# EAGLE schematic Fostex_CTRL (EAGLE 6.4)
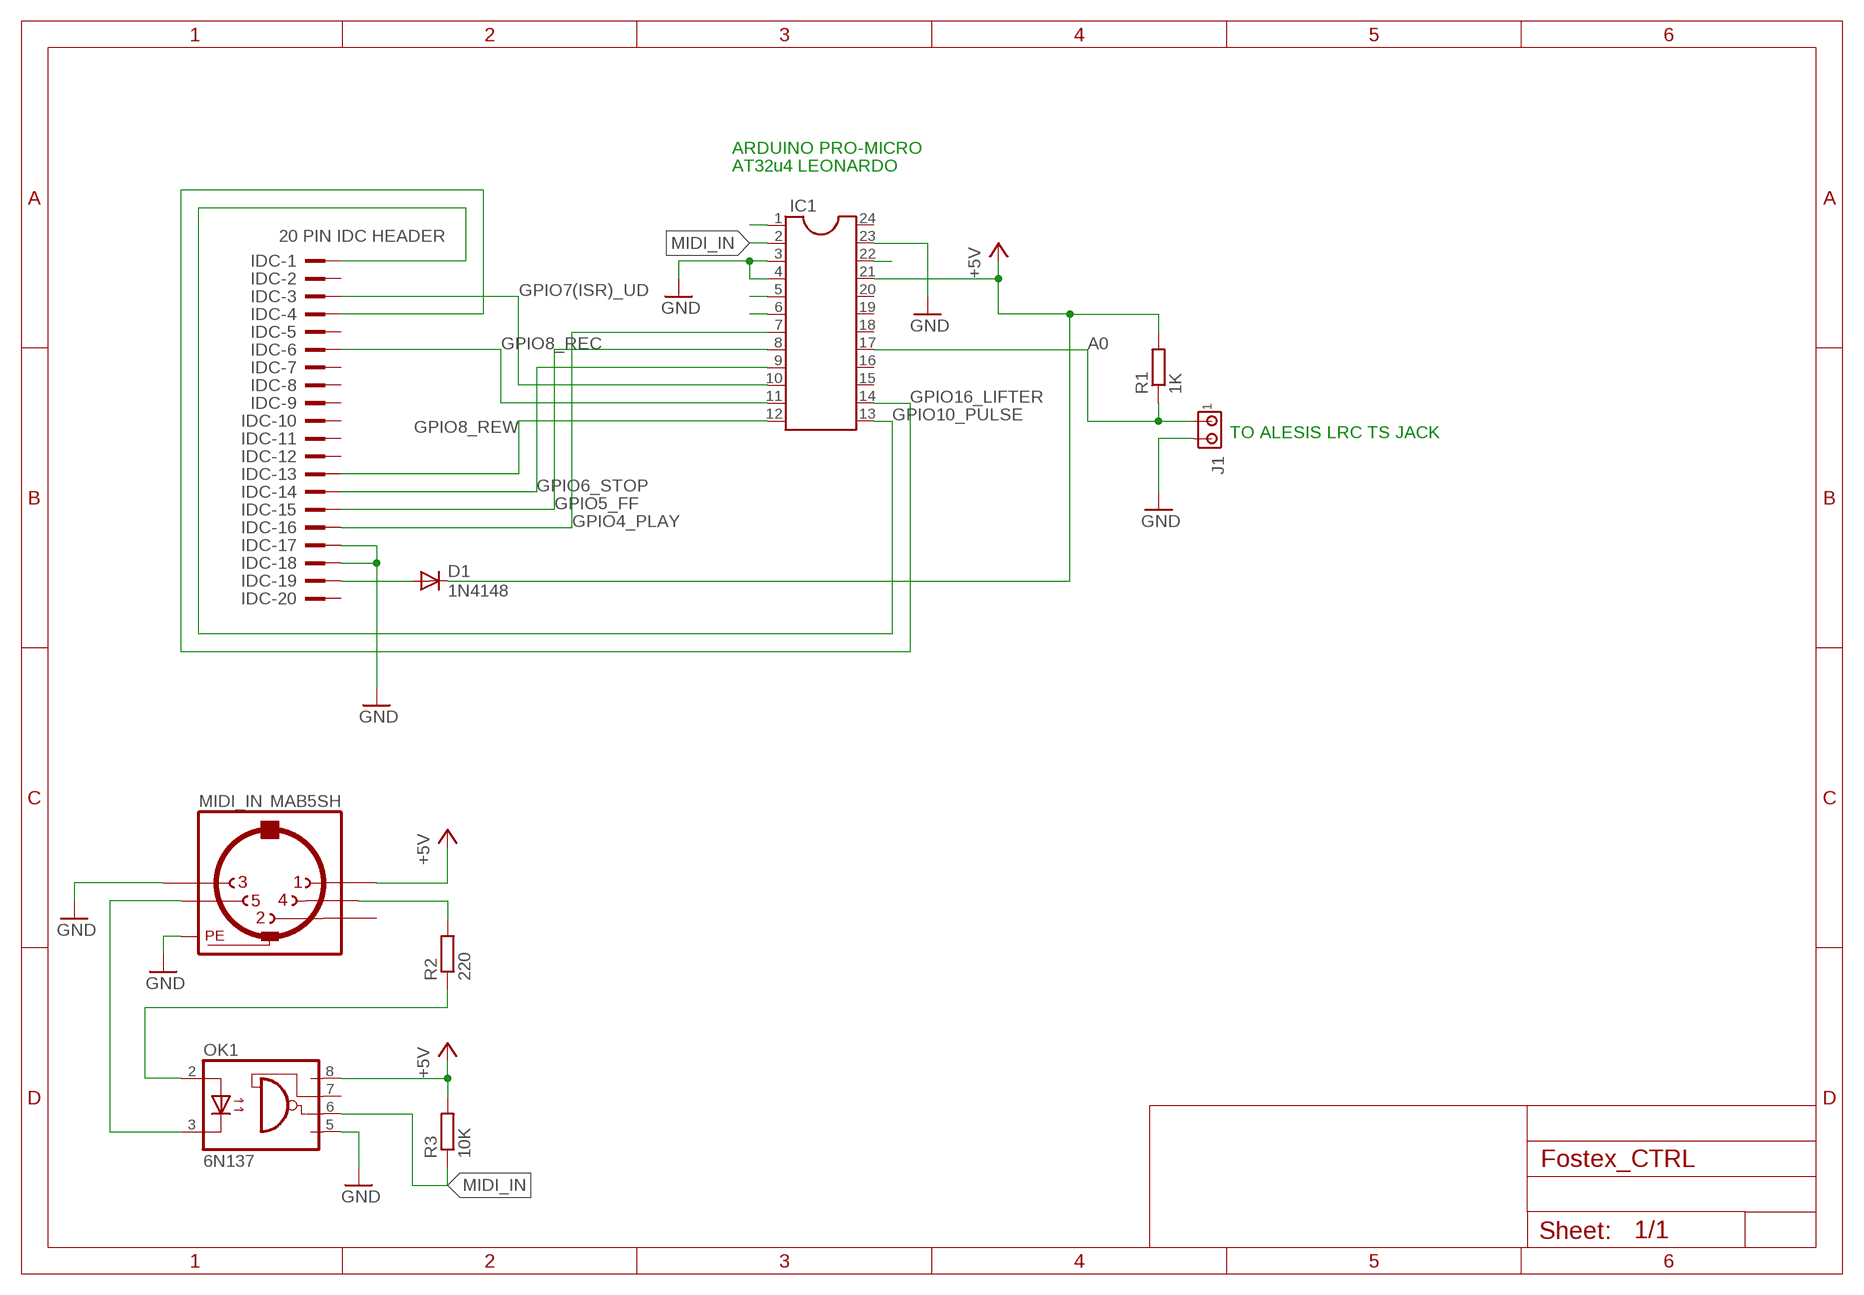
[diagram p0: schematic, sheet 1]

## Parts
D1  1N4148  1N4148DO35-7  [DO35-7]
IC1  DIL24-6  [DIL24-6]
IDC  20 PIN IDC HEADER  2520-  [PAK100/2500-20]
J1  MTA02-100  [10X02MTA]
MIDI_IN  MAB5SH  [MAB5SH]
OK1  6N137  [DIL08]
R1  1K  R-EU_0207/7  [0207/7]
R2  220  R-EU_0207/7  [0207/7]
R3  10K  R-EU_0207/7  [0207/7]

## Nets
+5V [5vdc]: D1.C IC1.21 MIDI_IN.1 OK1.8(VCC) R1.2 R3.2
A0: IC1.17 J1.1 R1.1
GND [gnd]: IC1.3 IC1.4 IC1.23 IDC.17 IDC.18 J1.2 MIDI_IN.3 MIDI_IN.PE MIDI_IN.PE@(PE) OK1.5(GND)
GPIO4_PLAY: IC1.7 IDC.16
GPIO5_FF: IC1.8 IDC.15
GPIO6_STOP: IC1.9 IDC.14
GPIO7(ISR)_UD: IC1.10 IDC.3
GPIO8_REC: IC1.11 IDC.6
GPIO8_REW: IC1.12 IDC.13
GPIO10_PULSE: IC1.13 IDC.1
GPIO16_LIFTER: IC1.14 IDC.4
MIDI_IN: IC1.2 OK1.6(VO) R3.1
MIDI_OUT: IC1.1
N$2: D1.A IDC.19
N$5: MIDI_IN.5 OK1.3(C)
N$6: OK1.2(A) R2.1
N$7: MIDI_IN.4 R2.2
P0: IC1.5
P1: IC1.6
RST: IC1.22
Unconnected: IC1.15 IC1.16 IC1.18 IC1.19 IC1.20 IC1.24 IDC.2 IDC.5 IDC.7 IDC.8 IDC.9 IDC.10 IDC.11 IDC.12 IDC.20 MIDI_IN.2 OK1.7(VE)

## Notes on the sheet
- ARDUINO PRO-MICRO
- AT32u4 LEONARDO
- TO ALESIS LRC TS JACK

## Library data of the parts
D1 = diode:1N4148: DIODE high speed (Philips)
IC1 = ic-package:DIL24: Dual In Line
IDC = con-3m:2520-: 3M (TM) Pak 100 4-Wall Header Source: 3M; OC_FARNELL: unknown; OC_NEWARK: unknown
J1 = con-amp:MTA02-100: AMP connector
MIDI_IN = con-hirschmann:MAB5SH: Female CONNECTOR 5 pins 90 deg. with shield, horizontal (DIN 41524); OC_FARNELL: 809883; OC_NEWARK: unknown
OK1 = optocoupler:6N137: MOTOROLA OPTO COUPLER; MPN: 6N137; OC_FARNELL: 1328376; OC_NEWARK: 52M1895
R1-R3 = rcl:R-EU_: RESISTOR, European symbol

## Net classes
0 default: width 0.254 mm, drill 0.127 mm, clearance 0.254 mm
1 5vdc: width 0.508 mm, drill 0.127 mm, clearance 0.406 mm
2 gnd: width 0.508 mm, drill 0.127 mm, clearance 0.508 mm